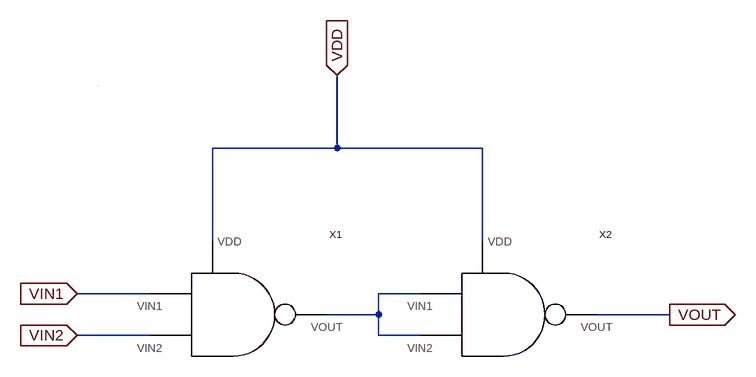
[diagram p0: schematic ANDbyNAND.asc]
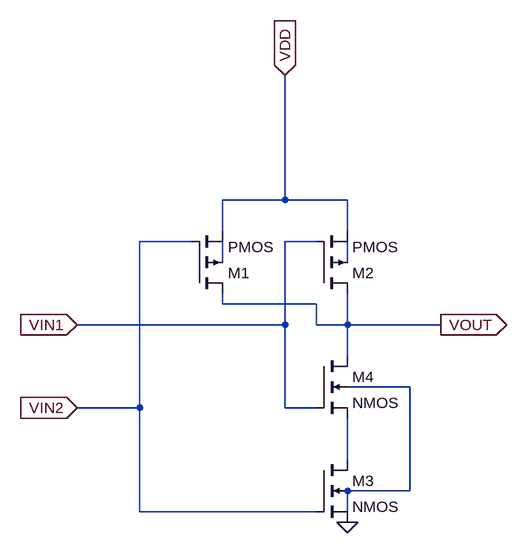
[diagram p1: sub-circuit nand.asc]
ANDbyNAND.asc, the LTspice schematic file:
Version 4
SHEET 1 1004 680
WIRE 368 96 368 -16
WIRE 368 96 176 96
WIRE 592 96 368 96
WIRE 176 240 176 96
WIRE 592 240 592 96
WIRE 80 320 -32 320
WIRE 496 320 432 320
WIRE 432 352 432 320
WIRE 432 352 352 352
WIRE 880 352 768 352
WIRE 80 384 -32 384
WIRE 432 384 432 352
WIRE 496 384 432 384
WIRE 0 0 0 0
FLAG -32 320 VIN1
IOPIN -32 320 In
FLAG -32 384 VIN2
IOPIN -32 384 In
FLAG 880 352 VOUT
IOPIN 880 352 Out
FLAG 368 -16 VDD
IOPIN 368 -16 In
SYMBOL NAND 192 352 R0
SYMATTR InstName X1
SYMBOL NAND 608 352 R0
SYMATTR InstName X2

nand.asc, the sub-circuit schematic file:
Version 4
SHEET 1 880 680
WIRE 32 -64 32 -256
WIRE 32 -64 -64 -64
WIRE 128 -64 32 -64
WIRE -64 -16 -64 -64
WIRE 128 -16 128 -64
WIRE -112 0 -192 0
WIRE 80 0 32 0
WIRE -64 32 -64 0
WIRE 128 32 128 0
WIRE -64 96 -64 80
WIRE 80 96 -64 96
WIRE 32 128 32 0
WIRE 32 128 -288 128
WIRE 80 128 80 96
WIRE 128 128 128 80
WIRE 128 128 80 128
WIRE 272 128 128 128
WIRE 128 176 128 128
WIRE 224 224 128 224
WIRE -192 256 -192 0
WIRE -192 256 -288 256
WIRE 32 256 32 128
WIRE 80 256 32 256
WIRE 128 336 128 272
WIRE 224 384 224 224
WIRE 224 384 128 384
WIRE -192 416 -192 256
WIRE 80 416 -192 416
WIRE 128 416 128 384
FLAG 128 432 0
FLAG -288 128 VIN1
IOPIN -288 128 In
FLAG -288 256 VIN2
IOPIN -288 256 In
FLAG 32 -256 VDD
IOPIN 32 -256 In
FLAG 272 128 VOUT
IOPIN 272 128 Out
SYMBOL pmos4 -112 80 M180
SYMATTR InstName M1
SYMATTR Value2 l=90n w=400n
SYMBOL pmos4 80 80 M180
SYMATTR InstName M2
SYMATTR Value2 l=90n w=400n
SYMBOL nmos4 80 336 R0
SYMATTR InstName M3
SYMATTR Value2 l=90n w=200n
SYMBOL nmos4 80 176 R0
SYMATTR InstName M4
SYMATTR Value2 l=90n w=200n

The netlist it stands for:
* ANDbyNAND.asc
XX1 VDD VIN1 N001 VIN2 nand
XX2 VDD N001 VOUT N001 nand

* block symbol definitions
.subckt nand VDD VIN1 VOUT VIN2
M1 VOUT VIN2 VDD N001 PMOS l=90n w=400n
M2 VOUT VIN1 VDD N002 PMOS l=90n w=400n
M3 N004 VIN2 0 N003 NMOS l=90n w=200n
M4 VOUT VIN1 N004 N003 NMOS l=90n w=200n
.ends nand

.model NMOS NMOS
.model PMOS PMOS
.lib standard.mos
.backanno
.end